# Altium schematic sheet Power.SchDoc
size A3; SheetNumber: 6; SheetTotal: 6
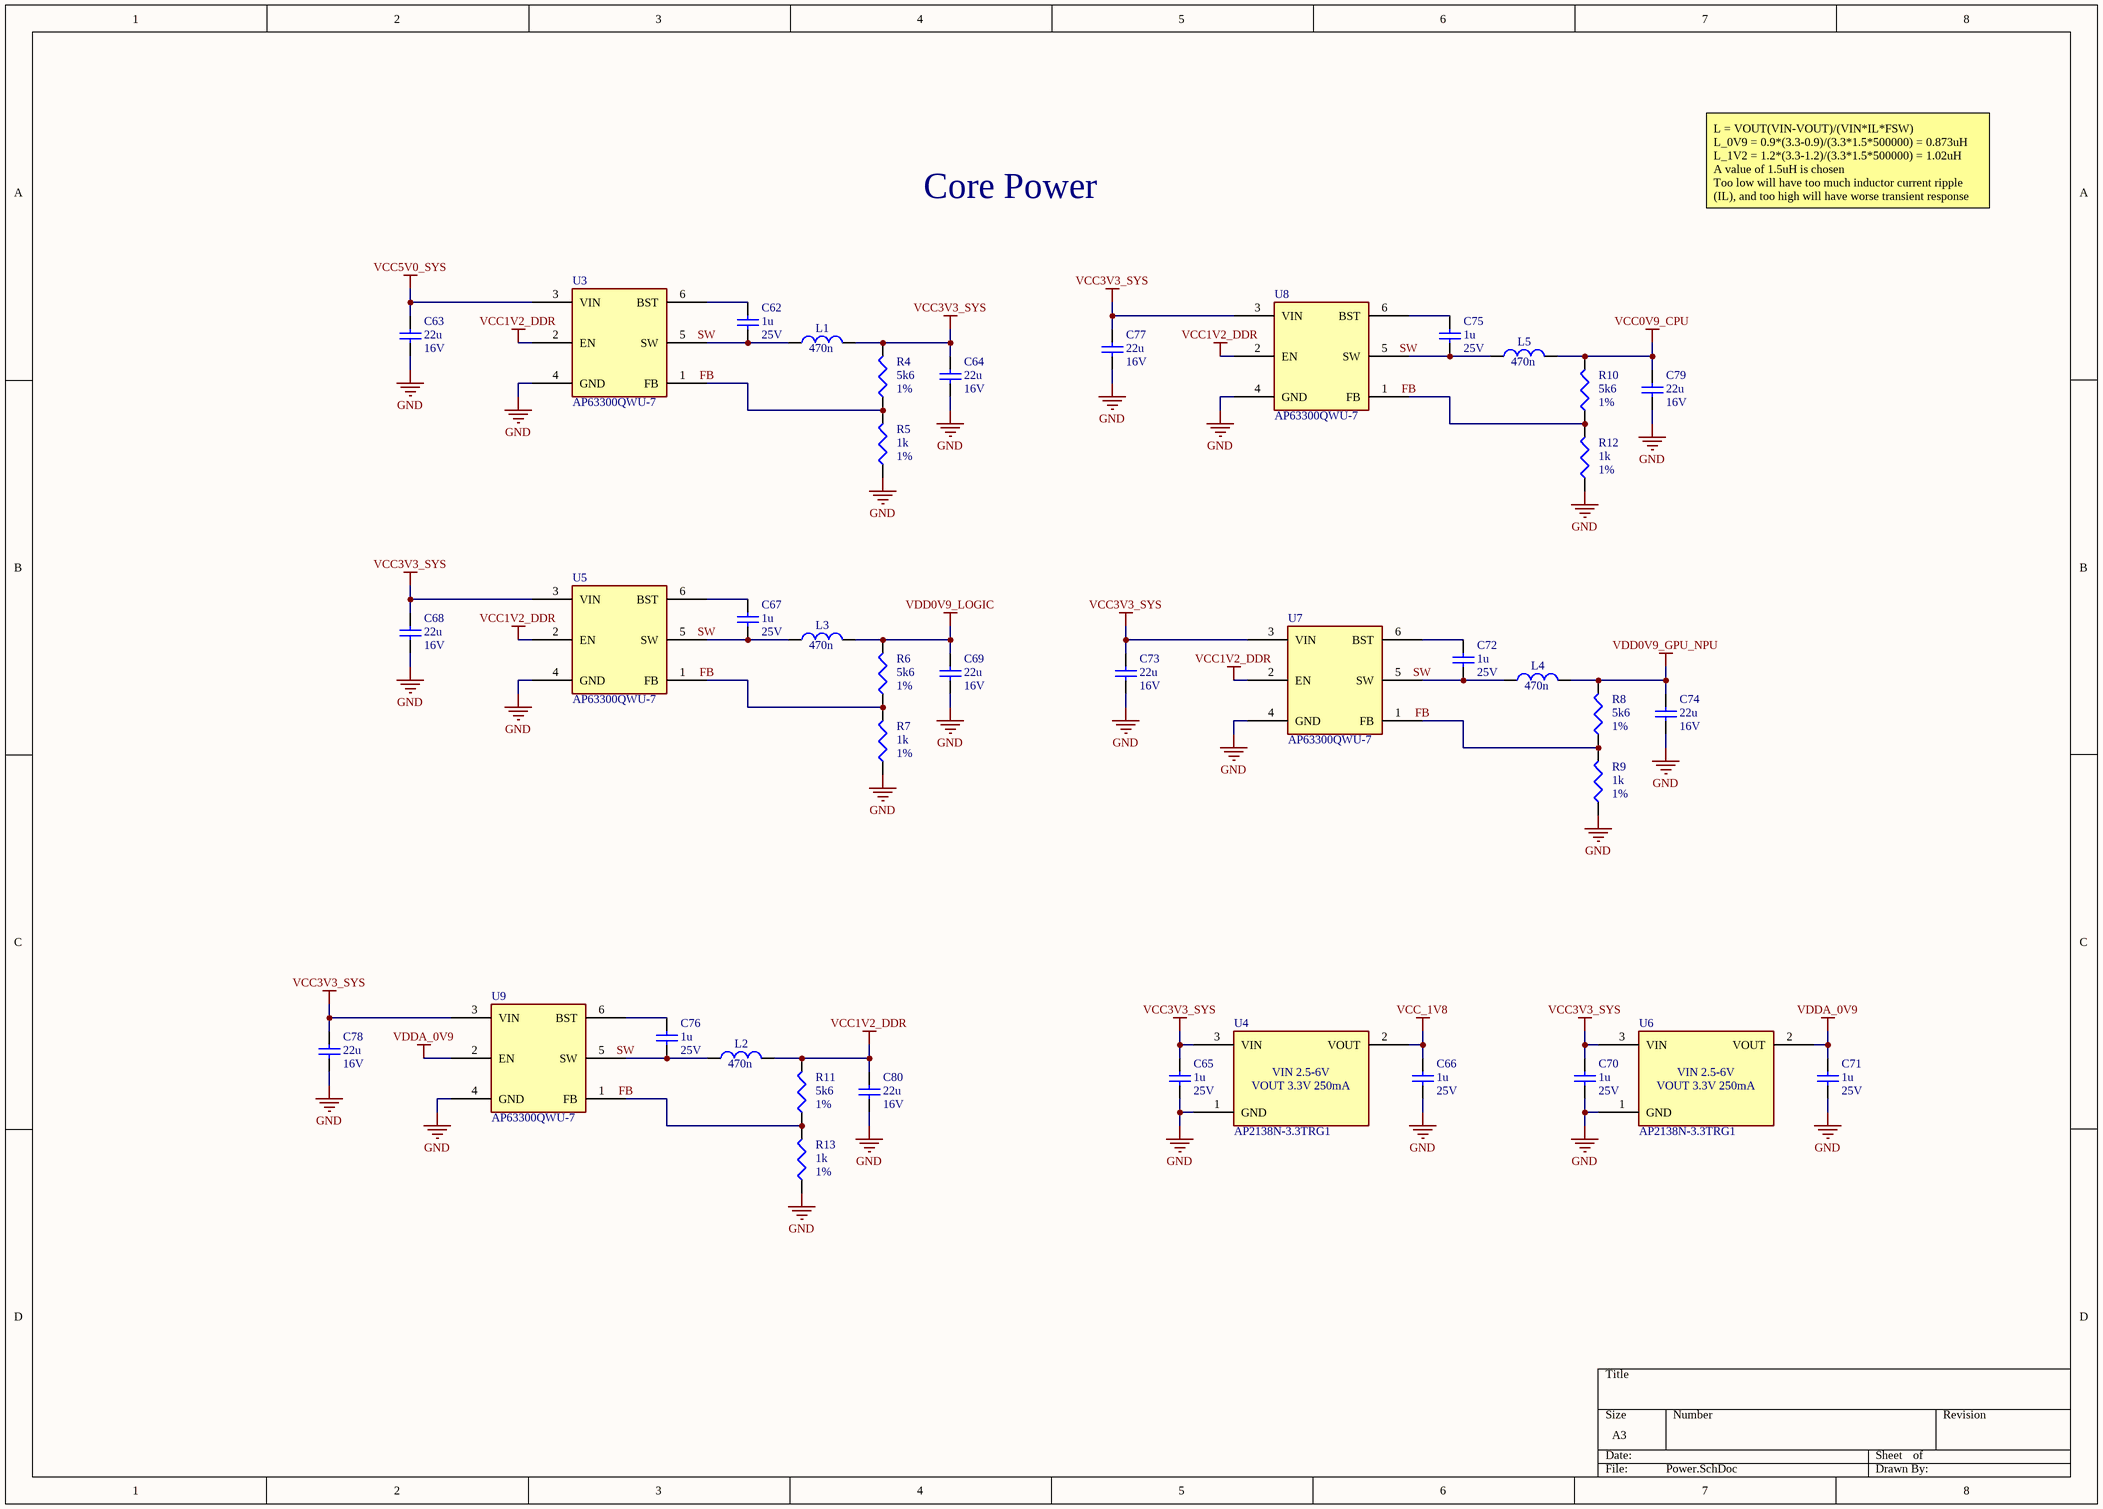
[diagram p0: Power.SchDoc]

## Parts
C62  value 1u  Voltage: 25V  [GRM155R61E105KA12D]  (hidden comment: GRM155R61E105KA12D)
C63  value 22u  Voltage: 16V  [GRM188R61C226ME01D]  (hidden comment: GRM188R61C226ME01D)
C64  value 22u  Voltage: 16V  [GRM188R61C226ME01D]  (hidden comment: GRM188R61C226ME01D)
C65  value 1u  Voltage: 25V  [GRM155R61E105KA12D]  (hidden comment: GRM155R61E105KA12D)
C66  value 1u  Voltage: 25V  [GRM155R61E105KA12D]  (hidden comment: GRM155R61E105KA12D)
C67  value 1u  Voltage: 25V  [GRM155R61E105KA12D]  (hidden comment: GRM155R61E105KA12D)
C68  value 22u  Voltage: 16V  [GRM188R61C226ME01D]  (hidden comment: GRM188R61C226ME01D)
C69  value 22u  Voltage: 16V  [GRM188R61C226ME01D]  (hidden comment: GRM188R61C226ME01D)
C70  value 1u  Voltage: 25V  [GRM155R61E105KA12D]  (hidden comment: GRM155R61E105KA12D)
C71  value 1u  Voltage: 25V  [GRM155R61E105KA12D]  (hidden comment: GRM155R61E105KA12D)
C72  value 1u  Voltage: 25V  [GRM155R61E105KA12D]  (hidden comment: GRM155R61E105KA12D)
C73  value 22u  Voltage: 16V  [GRM188R61C226ME01D]  (hidden comment: GRM188R61C226ME01D)
C74  value 22u  Voltage: 16V  [GRM188R61C226ME01D]  (hidden comment: GRM188R61C226ME01D)
C75  value 1u  Voltage: 25V  [GRM155R61E105KA12D]  (hidden comment: GRM155R61E105KA12D)
C76  value 1u  Voltage: 25V  [GRM155R61E105KA12D]  (hidden comment: GRM155R61E105KA12D)
C77  value 22u  Voltage: 16V  [GRM188R61C226ME01D]  (hidden comment: GRM188R61C226ME01D)
C78  value 22u  Voltage: 16V  [GRM188R61C226ME01D]  (hidden comment: GRM188R61C226ME01D)
C79  value 22u  Voltage: 16V  [GRM188R61C226ME01D]  (hidden comment: GRM188R61C226ME01D)
C80  value 22u  Voltage: 16V  [GRM188R61C226ME01D]  (hidden comment: GRM188R61C226ME01D)
L1  value 470n  [DFE322520FD-1R5M]  (hidden comment: DFE322520FD-1R5M)
L2  value 470n  [DFE322520FD-1R5M]  (hidden comment: DFE322520FD-1R5M)
L3  value 470n  [DFE322520FD-1R5M]  (hidden comment: DFE322520FD-1R5M)
L4  value 470n  [DFE322520FD-1R5M]  (hidden comment: DFE322520FD-1R5M)
L5  value 470n  [DFE322520FD-1R5M]  (hidden comment: DFE322520FD-1R5M)
R4  value 5k6  Tolerance: 1%  [RC0402FR-075K6L]  (hidden comment: RC0402FR-075K6L)
R5  value 1k  Tolerance: 1%  [RC0402FR-071KL]  (hidden comment: RC0402FR-071KL)
R6  value 5k6  Tolerance: 1%  [RC0402FR-075K6L]  (hidden comment: RC0402FR-075K6L)
R7  value 1k  Tolerance: 1%  [RC0402FR-071KL]  (hidden comment: RC0402FR-071KL)
R8  value 5k6  Tolerance: 1%  [RC0402FR-075K6L]  (hidden comment: RC0402FR-075K6L)
R9  value 1k  Tolerance: 1%  [RC0402FR-071KL]  (hidden comment: RC0402FR-071KL)
R10  value 5k6  Tolerance: 1%  [RC0402FR-075K6L]  (hidden comment: RC0402FR-075K6L)
R11  value 5k6  Tolerance: 1%  [RC0402FR-075K6L]  (hidden comment: RC0402FR-075K6L)
R12  value 1k  Tolerance: 1%  [RC0402FR-071KL]  (hidden comment: RC0402FR-071KL)
R13  value 1k  Tolerance: 1%  [RC0402FR-071KL]  (hidden comment: RC0402FR-071KL)
U3  AP63300QWU-7  [AP63300QWU-7]
U4  AP2138N-3.3TRG1  [AP2138N-3.3TRG1]
U5  AP63300QWU-7  [AP63300QWU-7]
U6  AP2138N-3.3TRG1  [AP2138N-3.3TRG1]
U7  AP63300QWU-7  [AP63300QWU-7]
U8  AP63300QWU-7  [AP63300QWU-7]
U9  AP63300QWU-7  [AP63300QWU-7]

## Nets
GND: C63.2 C64.2 C65.2 C66.2 C68.2 C69.2 C70.2 C71.2 C73.2 C74.2 C77.2 C78.2 C79.2 C80.2 R5.2 R7.2 R9.2 R12.2 R13.2 U3.4(GND) U4.1(GND) U5.4(GND) U6.1(GND) U7.4(GND) U8.4(GND) U9.4(GND)
VCC0V9_CPU: C79.1 L5.2 R10.1
VCC1V2_DDR: C80.1 L2.2 R11.1 U3.2(EN) U5.2(EN) U7.2(EN) U8.2(EN)
VCC3V3_SYS: C64.1 C65.1 C68.1 C70.1 C73.1 C77.1 C78.1 L1.2 R4.1 U4.3(VIN) U5.3(VIN) U6.3(VIN) U7.3(VIN) U8.3(VIN) U9.3(VIN)
VCC5V0_SYS: C63.1 U3.3(VIN)
VCC_1V8: C66.1 U4.2(VOUT)
VDD0V9_GPU_NPU: C74.1 L4.2 R8.1
VDD0V9_LOGIC: C69.1 L3.2 R6.1
VDDA_0V9: C71.1 U6.2(VOUT) U9.2(EN)
FB: R4.2 R5.1 R6.2 R7.1 R8.2 R9.1 R10.2 R11.2 R12.1 R13.1 U3.1(FB) U5.1(FB) U7.1(FB) U8.1(FB) U9.1(FB)
SW: C62.2 C67.2 C72.2 C75.2 C76.2 L1.1 L2.1 L3.1 L4.1 L5.1 U3.5(SW) U5.5(SW) U7.5(SW) U8.5(SW) U9.5(SW)
NetC62_1: C62.1 U3.6(BST)
NetC67_1: C67.1 U5.6(BST)
NetC72_1: C72.1 U7.6(BST)
NetC75_1: C75.1 U8.6(BST)
NetC76_1: C76.1 U9.6(BST)

## Notes on the sheet
- Core Power
- L = VOUT(VIN-VOUT)/(VIN*IL*FSW)
  L_0V9 = 0.9*(3.3-0.9)/(3.3*1.5*500000) = 0.873uH
  L_1V2 = 1.2*(3.3-1.2)/(3.3*1.5*500000) = 1.02uH
  A value of 1.5uH is chosen
  Too low will have too much inductor current ripple (IL), and too high will have worse transient response
- (in symbol AP2138N-3.3TRG1) VIN 2.5-6V; VOUT 3.3V 250mA

## Library data of the parts
C62 C65-C67 C70-C72 C75 C76 = GRM155R61E105KA12D: CAP 1U 25V X5R 0402; Size: 0402; Dielectric: X5R; Manufacturer Part Number 1: GRM155R61E105KA12D
C63 C64 C68 C69 C73 C74 C77-C80 = GRM188R61C226ME01D: CAP 22U 16V X5R 0603; Size: 0603; Dielectric: X5R; Manufacturer Part Number 1: GRM188R61C226ME01D
L1-L5 = DFE322520FD-1R5M: IND 1.5U 6A 1210
R4 R6 R8 R10 R11 = RC0402FR-075K6L: RES 5.6k 1% 62.5mW 0402; Size: 0603; Manufacturer Part Number 1: RC0402FR-075K6L
R5 R7 R9 R12 R13 = RC0402FR-071KL: RES 1k 1% 62.5mW 0402; Size: 0603; Manufacturer Part Number 1: RC0402FR-071KL
U3 U5 U7-U9 = AP63300QWU-7: BUCK 3A; Manufacturer Part Number 1: AP63300QWU-7
U4 U6 = AP2138N-3.3TRG1: LDO 3.3V 250mA; Manufacturer Part Number 1: AP2138N-3.3TRG1